# Altium schematic sheet GATE_DRIVE.SchDoc
size A
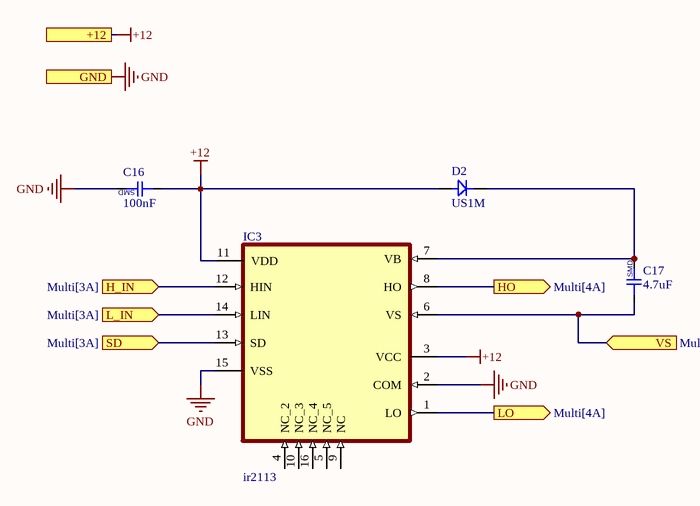
[diagram p0: GATE_DRIVE.SchDoc]

## Parts
C16  100nF  [CAP-0805]
C17  4.7uF  [CAP-0805]
D2  US1M  [DIOD/1N4007/SMD]
IC3  ir2113  [ir2113]

## Ports
+12, GND, H_IN (in, see Multi[3A]), HO (out, see Multi[4A]), L_IN (in, see Multi[3A]), LO (out, see Multi[4A]), SD (in, see Multi[3A]), VS (in, see Multi[4A])

## Nets
+12: C16.1 D2.A IC3.3(VCC) IC3.11(VDD) ; port +12
GND: C16.2 IC3.2(COM) IC3.15(VSS) ; port GND
H_IN: IC3.12(HIN) ; port H_IN
HO: IC3.8(HO) ; port HO
L_IN: IC3.14(LIN) ; port L_IN
LO: IC3.1(LO) ; port LO
SD: IC3.13(SD) ; port SD
VS: C17.1 IC3.6(VS) ; port VS
NetC17_2: C17.2 D2.K IC3.7(VB)

Not connected (* = marked no-connect by the designer): IC3 4(NC_2) 5(NC_5) 9(NC) 10(NC_3) 16(NC_4)

## Notes on the sheet
- (in symbol cap_smd) SMD

## Library data of the parts
C16 C17 = cap_smd
D2 = DIOD/RECTIFIERS